# Altium project DIOT_PSU_integrated.PrjPcb
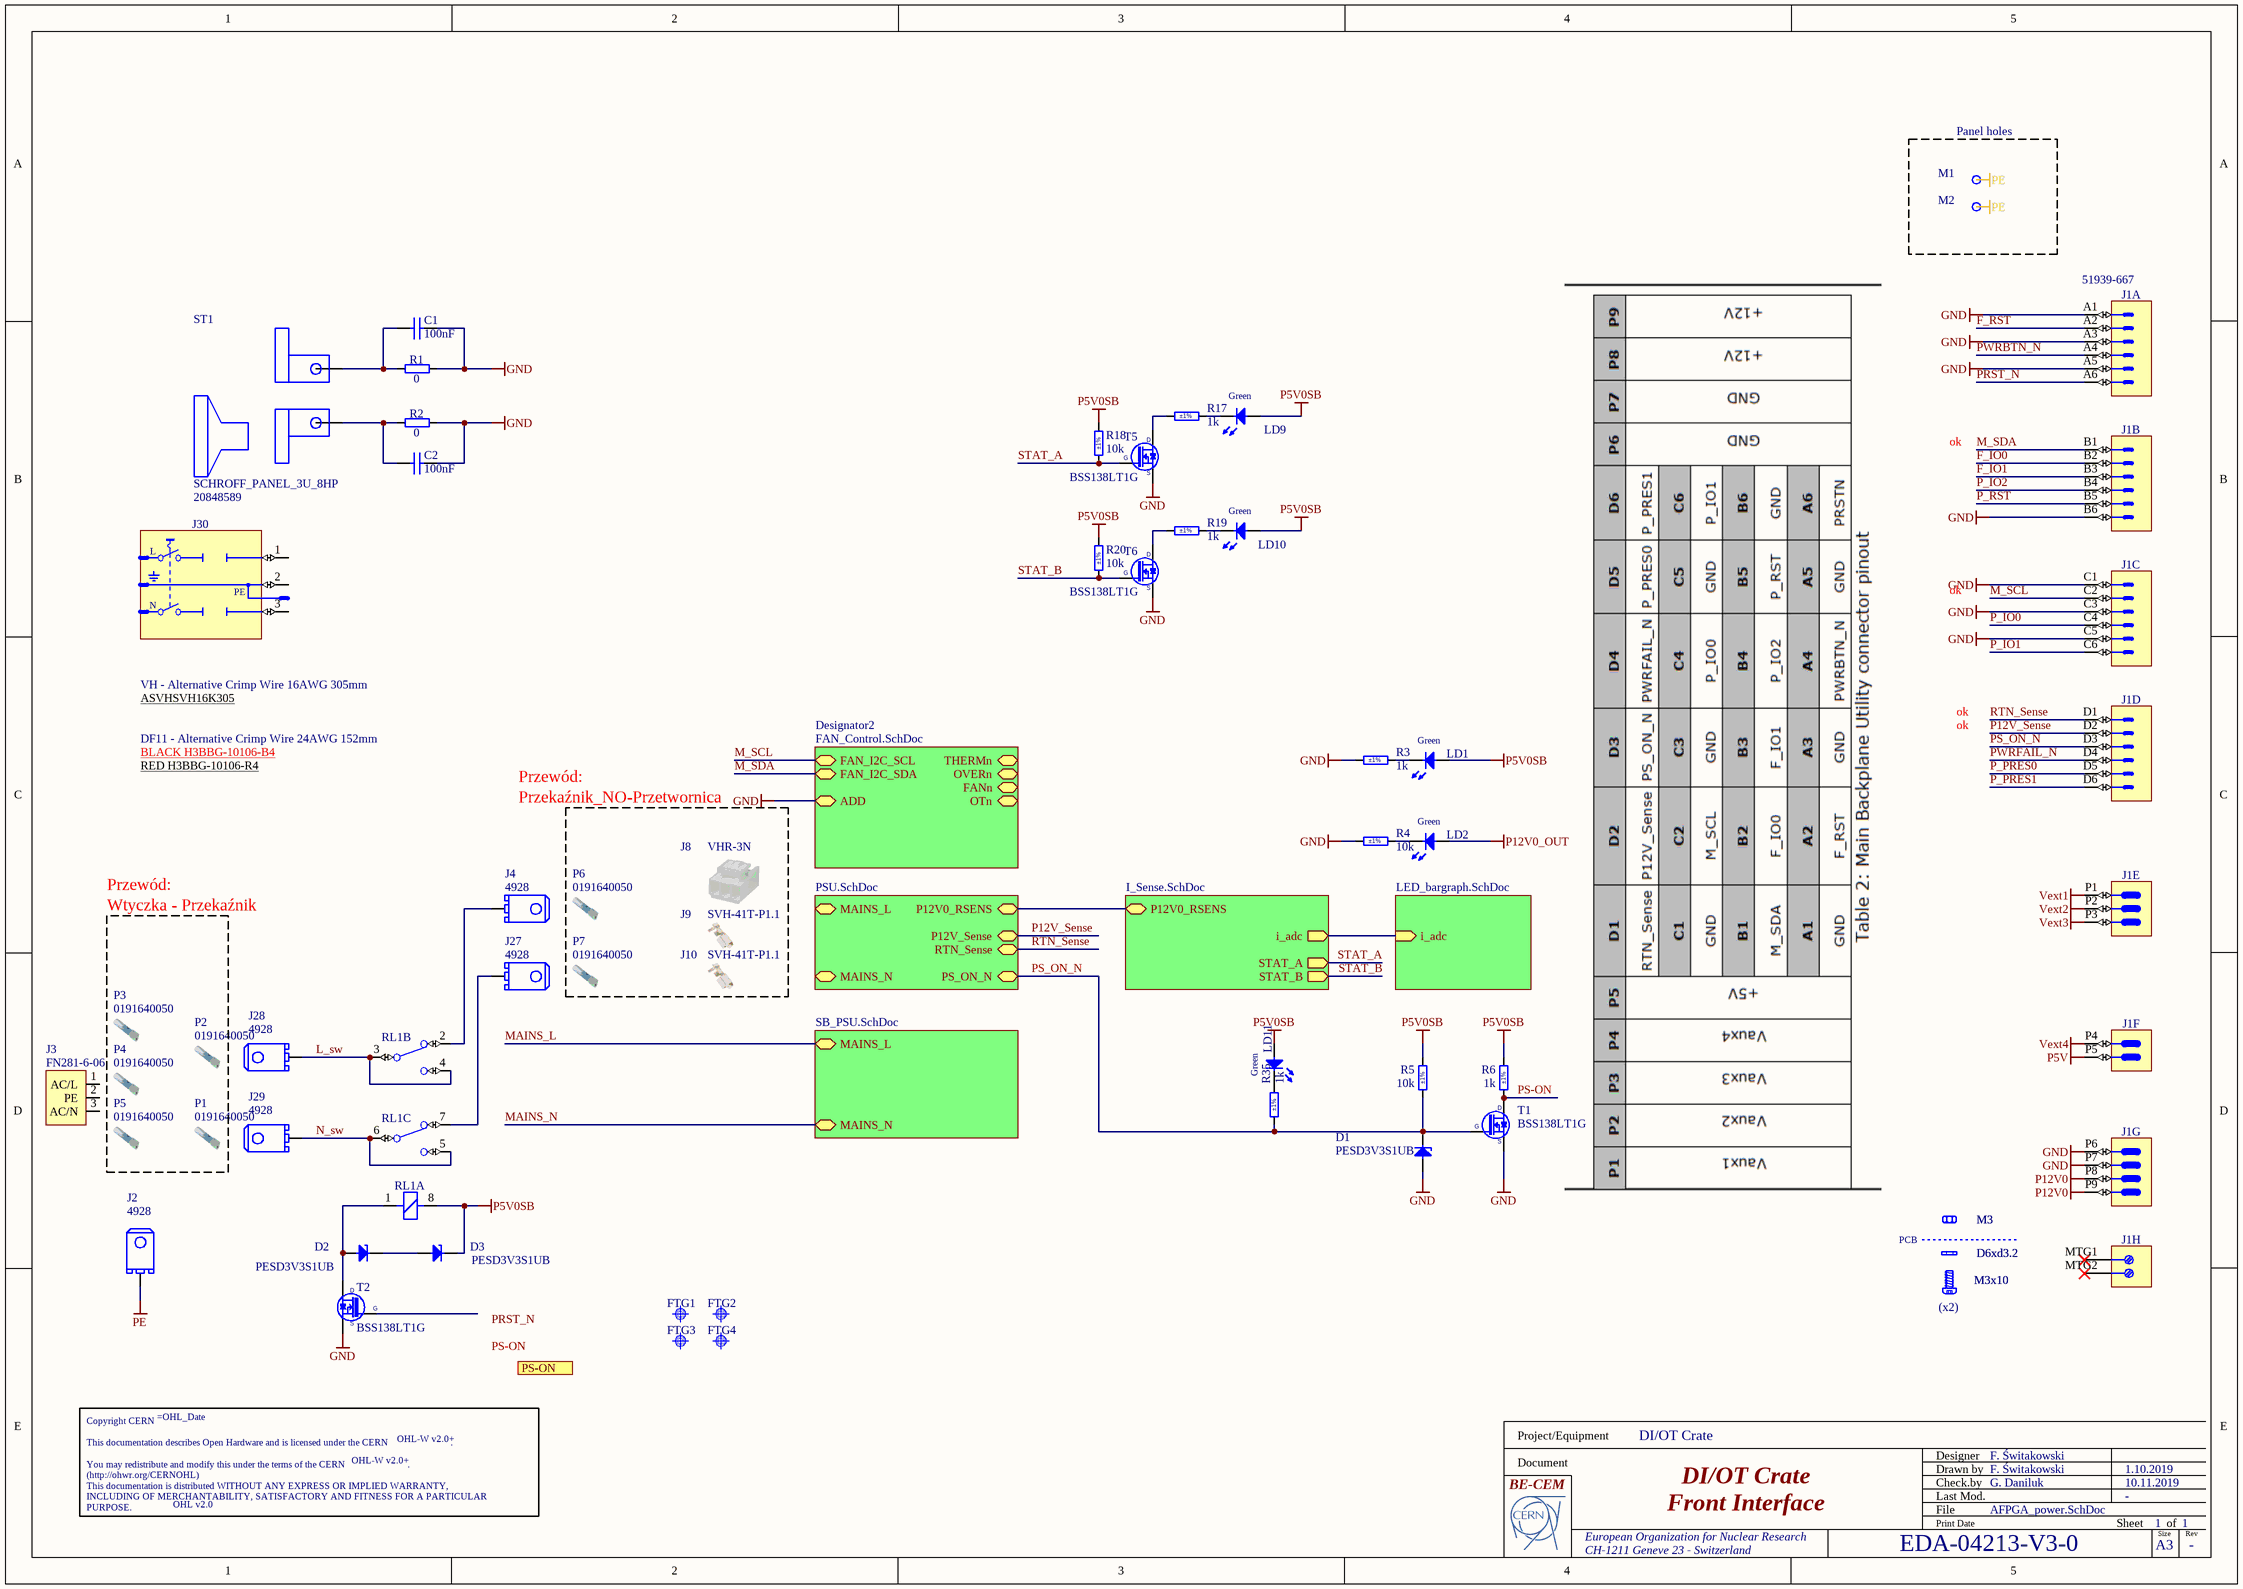
[diagram p0: DIOT_PSU_integrated.SchDoc]
OHL_License: OHL-W v2.0+; wikis: https://ohwr.org/project/diot-crate-hw/wikis
4 sheets, 89 parts. Net scope: hierarchical (ports join the sheet entries above them; power ports are global).
Board files: DIOT_PSU_doutherBoard.PcbDoc, DIOT_PSU_integrated.PcbDoc
Sheets:
  DIOT_PSU_integrated.SchDoc
    Designator2 = FAN_Control.SchDoc
    Designator3 = I_Sense.SchDoc
    Designator5 = SB_PSU.SchDoc

## Sheet DIOT_PSU_integrated.SchDoc: DI/OT Crate
size 420 x 297 mm; Project: DI/OT Backplane - Front panel PCB; CheckedBy: G. Daniluk; Author: F. Świtakowski; CompanyName: Creotech Instruments SA; DrawnBy: F. Świtakowski; Organization: CERN; Address1: European Organization for Nuclear Research; Address2: CH-1211 Geneve 23 - Switzerland; DocumentNumber: 1; Revision: -; SheetNumber: 1; SheetTotal: 1; EDA_Number: EDA-04213-V3-0; Projet: DI/OT Crate; CreateDate: 1.10.2019; CheckedDate: 10.11.2019; Title2: Front Interface; DivGrp: BE-CEM; Designer: F. Świtakowski; SPICEModelCacheTQWPXFHW: <root> / <DocumentId>TQWPXFHW</DocumentId> / </root>; DocumentName: AFPGA_power.SchDoc; ModifiedDate: -; Rule: PcbType=ProtelPcb

### Parts
C1  100nF  [CAPC1608X87N]
C2  100nF  [CAPC1608X87N]
D1  PESD3V3S1UB  [SODFL1608X65N]
D2  PESD3V3S1UB  [SODFL1608X65N]
D3  PESD3V3S1UB  [SODFL1608X65N]
FTG1  Use only in PCB  [FIDUCIAL_TOP_C100-200]  (value not drawn)
FTG2  Use only in PCB  [FIDUCIAL_TOP_S100-200]  (value not drawn)
FTG3  Use only in PCB  [FIDUCIAL_TOP_C100-200]  (value not drawn)
FTG4  Use only in PCB  [FIDUCIAL_TOP_S100-200]  (value not drawn)
J1  Manufacturer Part Number: 51939-667  [AMPHENOL_51939-667]  (hidden comment: PwrBlade)  (parts A,B,C,D,E,F,G,H of 8)
J2  4928  [KEYSTONE_4928]
J3  FN281-6-06  [FN9264-2-06]
J4  4928  [KEYSTONE_4928]
J8  VHR-3N  [VHR-3N]
J9  SVH-41T-P1.1  [SVH-41T-P1.1]
J10  SVH-41T-P1.1  [SVH-41T-P1.1]
J27  4928  [KEYSTONE_4928]
J28  4928  [KEYSTONE_4928]
J29  4928  [KEYSTONE_4928]
J30  IEC  [SCHURTER_DD21.0121.1111]  (value not drawn)
LD1  Green  [LED_AVAGO_HSME-C120]
LD2  Green  [LED_AVAGO_HSME-C120]
LD9  Green  [LED_AVAGO_HSME-C120]
LD10  Green  [LED_AVAGO_HSME-C120]
LD11  Green  [LED_AVAGO_HSME-C120]
M1  Plated Hole  [MTG300_600]  (value not drawn)  (no BOM)
M2  Plated Hole  [MTG300_600]  (value not drawn)  (no BOM)
NUT1  M3  [BOSSARD_BN628-1241443_v]
NUT2  M3  [BOSSARD_BN628-1241443_v]
OHL1  CERN_OHL  [CERN_OHL]  (value not drawn)  (no BOM)
P1  0191640050  [0191640050]
P2  0191640050  [0191640050]
P3  0191640050  [0191640050]
P4  0191640050  [0191640050]
P5  0191640050  [0191640050]
P6  0191640050  [0191640050]
P7  0191640050  [0191640050]
R1  0  [RESC1608X55N]
R2  0  [RESC1608X55N]
R3  1k  Tolerance: ±1%  [RESC1608X55N]
R4  10k  Tolerance: ±1%  [RESC1608X55N]
R5  10k  Tolerance: ±1%  [RESC1608X55N]
R6  1k  Tolerance: ±1%  [RESC1608X55N]
R17  1k  Tolerance: ±1%  [RESC1608X55N]
R18  10k  Tolerance: ±1%  [RESC1608X55N]
R19  1k  Tolerance: ±1%  [RESC1608X55N]
R20  10k  Tolerance: ±1%  [RESC1608X55N]
R35  1k  Tolerance: ±1%  [RESC1608X55N]
RL1  REL_OMRON_G2RL-24  [REL_OMRON_G2RL-24]  (value not drawn)  (parts A,B,C of 3)
SCREW1  M3x10  [BOSSARD_BN5687-3061608_v]
SCREW2  M3x10  [BOSSARD_BN5687-3061608_v]
ST1  SCHROFF_PANEL_3U_8HP  Manufacturer Part Number 2: 20848589  [SCHROFF_PANEL_3HP_8U_CPCIS_AC_PSU]
T1  BSS138LT1G  [SOT95P240X110-3N]
T2  BSS138LT1G  [SOT95P240X110-3N]
T5  BSS138LT1G  [SOT95P240X110-3N]
T6  BSS138LT1G  [SOT95P240X110-3N]
WASHER1  D6xd3.2  [BOSSARD_BN83728-8243964_v]
WASHER2  D6xd3.2  [BOSSARD_BN83728-8243964_v]

### Blocks framed on the sheet
Panel holes: M1 M2
Wtyczka - Przekaźnik: P1-P5

### Sub-sheets
Designator1 = LED_bargraph.SchDoc (file not in this document): i_adc (in)
Designator2 = FAN_Control.SchDoc: ADD (bidir), THERMn (bidir), OVERn (bidir), FANn (bidir), FAN_I2C_SCL (bidir), FAN_I2C_SDA (bidir), OTn (bidir)
Designator3 = I_Sense.SchDoc: i_adc (out), STAT_A (out), STAT_B (out), P12V0_RSENS (bidir)
Designator4 = PSU.SchDoc (file not in this document): P12V_Sense (bidir), RTN_Sense (bidir), PS_ON_N (bidir), MAINS_L (bidir), MAINS_N (bidir), P12V0_RSENS (bidir)
Designator5 = SB_PSU.SchDoc: MAINS_L (bidir), MAINS_N (bidir)

### Ports
PS-ON (in)

### Nets
GND: C1.1 C2.1 D1.2(A) J1.A1 J1.A3 J1.A5 J1.B6 J1.C1 J1.C3 J1.C5 J1.P6 J1.P7 R1.2 R2.2 R3.1 R4.1 T1.2(S) T2.2(S) T5.2(S) T6.2(S) ; sheet Designator2/ADD
P5V: J1.P5
P5V0SB: D3.1(C) LD1.2(A) LD9.2(A) LD10.2(A) LD11.2(A) R5.2 R6.2 R18.2 R20.2 RL1.8
P12V0: J1.P8 J1.P9
P12V0_OUT: LD2.2(A)
PE: J2.1 M1.1 M2.1
Vext1: J1.P1
Vext2: J1.P2
Vext3: J1.P3
Vext4: J1.P4
F_IO0: J1.B2
F_IO1: J1.B3
F_RST: J1.A2
i_adc: sheet Designator1/i_adc, sheet Designator3/i_adc
L_sw: J28.1 RL1.3(C) RL1.4(NO)
M_SCL: J1.C2 ; sheet Designator2/FAN_I2C_SCL
M_SDA: J1.B1 ; sheet Designator2/FAN_I2C_SDA
N_sw: J29.1 RL1.5(NO) RL1.6(C)
P12V0_RSENS: sheet Designator3/P12V0_RSENS, sheet Designator4/P12V0_RSENS
P12V_Sense: J1.D2 ; sheet Designator4/P12V_Sense
P_IO0: J1.C4
P_IO1: J1.C6
P_IO2: J1.B4
P_PRES0: J1.D5
P_PRES1: J1.D6
P_RST: J1.B5
PRST_N: J1.A6
PS-ON: R6.1 T1.3(D)
PS_ON_N: D1.1(C) J1.D3 R5.1 R35.1 T1.1(G) ; sheet Designator4/PS_ON_N
PWRBTN_N: J1.A4
PWRFAIL_N: J1.D4
RTN_Sense: J1.D1 ; sheet Designator4/RTN_Sense
STAT_A: R18.1 T5.1(G) ; sheet Designator3/STAT_A
STAT_B: R20.1 T6.1(G) ; sheet Designator3/STAT_B
NetC1_2: C1.2 R1.1 ST1.MH1
NetC2_2: C2.2 R2.1 ST1.MH2
NetD2_1: D2.1(C) D3.2(A)
NetD2_2: D2.2(A) RL1.1 T2.3(D)
NetJ4_1: J4.1 RL1.2(NC)
NetJ27_1: J27.1 RL1.7(NC)
NetLD1_1: LD1.1(C) R3.2
NetLD2_1: LD2.1(C) R4.2
NetLD9_1: LD9.1(C) R17.2
NetLD10_1: LD10.1(C) R19.2
NetLD11_1: LD11.1(C) R35.2
NetR17_1: R17.1 T5.3(D)
NetR19_1: R19.1 T6.3(D)

Not connected (* = marked no-connect by the designer): J1 MTG1* MTG2*; J3 1(AC/L) 2(PE) 3(AC/N); J30 1 2 3; T2 1(G)

### Notes on the sheet
- ok
- ASVHSVH16K305 <https://www.digikey.pl/en/products/detail/jst-sales-america-inc/ASVHSVH16K305/6009483>
- VH - Alternative Crimp Wire 16AWG 305mm
- DF11 - Alternative Crimp Wire 24AWG 152mm
- BLACK H3BBG-10106-B4 <https://www.digikey.pl/en/products/detail/jst-sales-america-inc/ASVHSVH16K203/9924197>
- RED H3BBG-10106-R4 <https://www.digikey.pl/en/products/detail/hirose-electric-co-ltd/H3BBG-10106-R4/312538?s=N4IgTCBcDaIBIGYBCSDiBaAjABhwNnQCUAWEAXQF8g>
- Przewód:
- (near J8) Przekaźnik_NO-Przetwornica
- PCB
- (x2)
- Labels drawn without touching a wire or pin: PRST_N, PS-ON
- Project/Equipment
- Document
- Designer
- Drawn by
- Check.by
- File
- Last Mod.
- Print Date
- Sheet
- Size
- A3
- of
- Rev
- (in symbol CERN_OHL) Copyright CERN / This documentation describes Open Hardware and is licensed under the CERN                         . / You may redistribute and modify this under the terms of the CERN                         . / (http://ohwr.org/CERNOHL) / This documentation is distributed WITHOUT ANY EXPRESS OR IMPLIED WARRANTY, / INCLUDING OF MERCHANTABILITY, SATISFACTORY AND FITNESS FOR A PARTICULAR PURPOSE. / Please see the CERN                   for applicable conditions.
- (in symbol SCHURTER_DD21.0121.1111) L; PE; N

### Library data of the parts
C1 C2 = CC0603_100NF_50V_10%_X5R: Non-polarised capacitor; Part Description: SMD Multilayer Chip Ceramic Capacitor; Manufacturer: GENERIC; Manufacturer1 Part Number: C1608X5R1H104K080; Voltage: 50V; TC: X5R; Tolerance: ±10%; Part Number: CC0603_100NF_50V_10%_X5R; Component Kind: Standard; Component Type: Standard; Pin Count: 2; Value: 100nF; Status: None; Manufacturer Part Number: CC0603_100NF_50V_10%_X5R; Case: 0603; Mounted: Yes; Socket: No; SMD: Yes; Sense: No; Manufacturer1 Example: TDK; Manufacturer1 ComponentHeight: 0.9mm; HelpURL: \\cern.ch\dfs\Applications\Altium\Datasheets\CC0603_X5R_TDK_C.pdf; Author: CERN DEM MR; CreateDate: 08.01.2016; LatestRevisionDate: 08.01.2016
D1-D3 = PESD3V3S1UB: ESD protection diode; Part Description: ESD protection diode (23kV); Manufacturer: NXP SEMICONDUCTORS; Voltage: 3V3; Power: 330W; PressFit: No; Bonding: No; Part Number: PESD3V3S1UB; Component Kind: Standard; Component Type: Standard; Device: PESD3V3S1UB; PackageDescription: Ultra Small Outline Diode Flat Lead (SOD-523), Body; 1.2mm L X 0.8mm W X 0.65mm H, IPC Medium Density; Manufacturer Part Number: PESD3V3S1UB; Pin Count: 2; Case: SOD523; Mounted: Yes; Socket: No; SMD: Yes; Sense: No; ComponentHeight: 0.65mm; HelpURL: \\cern.ch\dfs\Applications\Altium\Datasheets\PESD3V3S1UB.pdf; Author: CERN DEM JLC; CreateDate: 29.11.2012; LatestRevisionDate: 29.11.2012
FTG1 FTG3 = FIDUCIAL_TARGET_C100-200: Fiducial Target; Part Description: Round Fiducial Target, Top Layer, 1.0mm, Top Solder 2.0mm, Keepout =2.0mm; Mounted: No; Part Number: FIDUCIAL_TARGET_C100-200; Component Kind: Standard (No BOM); Component Type: Standard (No BOM); Pin Count: 1; Family: Fiducial; Socket: No; SMD: Yes; Sense: No; Status: None; ComponentHeight: 0mm; HelpURL: Undefined; Author: CERN DEM JLC; CreateDate: 09.02.2010; LatestRevisionDate: 04.04.2012; PackageDescription: Round Fiducial Target, Top Layer, 1.0mm, Top Solder 2.0mm, Keepout =2.0mm
FTG2 FTG4 = FIDUCIAL_TARGET_S100-200: Fiducial Target; Part Description: Square Fiducial Target, Top Layer, 1.0mm, Top Solder 2.0mm, Keepout =2.0mm; Mounted: No; Part Number: FIDUCIAL_TARGET_S100-200; Component Kind: Standard (No BOM); Component Type: Standard (No BOM); Pin Count: 1; Family: Fiducial; Socket: No; SMD: Yes; Sense: No; Status: None; ComponentHeight: 0mm; HelpURL: Undefined; Author: CERN DEM JLC; CreateDate: 09.02.2010; LatestRevisionDate: 04.04.2012; PackageDescription: Square Fiducial Target, Top Layer, 1.0mm, Top Solder 2.0mm, Keepout =2.0mm
J1 = AMPHENOL_51939-667: Thru-Hole, Lead 3.43mm, PowerBlade Right Angled Power Connector 3ACP 2P 24S 4P Contacts; Part Description: Right Angle PowerBlade Power Connector 3ACP + 2P + 24S + 4P Contacts; PressFit: No; Part Number: AMPHENOL_51939-667; Component Kind: Standard; Component Type: Standard; Pin Count: 33; Family: PwrBlade; Mounted: Yes; Socket: No; SMD: No; Sense: No; Status: None; Manufacturer: AMPHENOL; ComponentHeight: 12.57mm; HelpURL: \\cern.ch\dfs\Applications\Altium\Datasheets\AMPHENOL_51939-667.pdf; Author: CERN DEM JLC; CreateDate: 05.03.2019; LatestRevisionDate: 05.03.2019
J2 J4 J27-J29 = KEYSTONE_4928: 0.240" (6.10mm) Quick Connect Male Solder Connector Non-Insulated; PressFit: No; Part Number: 4928; Component Kind: Standard; Component Type: Standard; Pin Count: 4; Mounted: Yes; Socket: No; SMD: No; Sense: No; Status: None; Part Description: 0.240" (6.10mm) Quick Connect Male Solder Connector Non-Insulated; Manufacturer: KEYSTONE; Manufacturer Part Number: 4928; ComponentHeight: 10.49mm; HelpURL: https://www.keyelco.com/product-pdf.cfm?p=14309; Author: LPA; CreateDate: 18.02.2025; LatestRevisionDate: 18.02.2025; ComponentLink1Description: Datasheet; ComponentLink1URL: https://www.keyelco.com/product-pdf.cfm?p=14309
J3 = FN281-6-06: Power Entry Connector Receptacle, Male Blades - Module IEC 320-C14 Panel Mount, Flange; Manufacturer: Schaffner EMC Inc.; PressFit: No; Part Number: FN281-6-06; Footprint: FN281-6-06; Pin Count: 3; Mounted: Yes; Socket: No; SMD: No; Sense: No; Status: None; Part Description: Power Entry Connector Receptacle, Male Blades - Module IEC 320-C14 Panel Mount, Flange; Manufacturer Part Number: FN281-6-06; ComponentHeight: 35; HelpURL: https://www.schaffner.com/product/FN280/Schaffner_datasheet_FN280.pdf; Author: LPA; CreateDate: 08.02.2025; LatestRevisionDate: 08.02.2025; ComponentLink1Description: Datasheet; ComponentLink1URL: https://www.digikey.pl/pl/products/detail/schaffner-emc-inc/FN281-6-06/1997105?srsltid=AfmBOopo_2hCIzMtiGmdja5qUgne8hiecT0bkO3ZLGT1zD_KD1Bja1J0
J8 = VHR-3N: 3 Rectangular Connectors - Housings Receptacle Natural 0.156" (3.96mm); Manufacturer: JST Sales America Inc.; PressFit: No; Part Number: VHR-3N; Component Kind: Standard; Component Type: Standard; Pin Count: 1; Family: VH; Mounted: Yes; Socket: No; SMD: No; Sense: No; Status: None; Part Description: 3 Rectangular Connectors - Housings Receptacle Natural 0.156" (3.96mm); Manufacturer Part Number: VHR-3N; HelpURL: https://www.jst-mfg.com/product/pdf/eng/eVH.pdf; Author: LPA; CreateDate: 09.02.2025; LatestRevisionDate: 09.02.2025
J9 J10 = SVH-41T-P1.1: Socket Contact Tin 16-20 AWG Crimp; Manufacturer: JST Sales America Inc.; PressFit: No; Part Number: SVH-41T-P1.1; Component Kind: Socket Contact; Component Type: Socket Contact; Pin Count: 1; Family: vh; Mounted: Yes; Socket: No; SMD: No; Sense: No; Status: None; Part Description: Socket Contact Tin 16-20 AWG Crimp; Manufacturer Part Number: SVH-41T-P1.1; ComponentHeight: N/A; HelpURL: https://www.jst-mfg.com/product/pdf/eng/eVH.pdf; Author: LPA; CreateDate: 09.02.2025; LatestRevisionDate: 09.02.2025
J30 = SCHURTER_DD21.0121.1111: Connector 3 Male 2P+ 2 Fuse Holder + Line Switch 2 Poles; Part Description: 10A 250Vac IEC Appliance Inlet C14 with Line Switch 2-Pole, Fuseholder 2-Pole for Fuse Links 5x20mm; PressFit: No; Part Number: SCHURTER_DD21.0121.1111; Component Kind: Standard; Component Type: Standard; Pin Count: 3; Family: IEC; Mounted: Yes; Socket: No; SMD: No; Sense: No; Status: None; Manufacturer: SCHURTER; Manufacturer Part Number: DD21.0121.1111; ComponentHeight: 32.3mm; HelpURL: \\cern.ch\dfs\Applications\Altium\Datasheets\SCHURTER_DD21.0121.1111.pdf; Author: CERN DEM JLC; CreateDate: 19.11.2012; LatestRevisionDate: 19.11.2012
LD1 LD2 LD9-LD11 = LED_AVAGO_HSME-C120: LED Green 1C 2A; Part Description: High Performance Right Angle Chip Green LED; Manufacturer: AVAGO TECHNOLOGIES; PressFit: No; Bonding: No; Part Number: LED_AVAGO_HSME-C120; Component Kind: Standard; Component Type: Standard; Color: Green; PackageDescription: Green Chip LED, 2-Leads, Body 1.7x1.1mm, Side Emitting Package; Manufacturer Part Number: HSME-C120; Pin Count: 2; Mounted: Yes; Socket: No; SMD: Yes; Sense: No; ComponentHeight: 0.7mm; HelpURL: \\cern.ch\dfs\Applications\Altium\Datasheets\LED_AVAGO_HSME-C120.pdf; ComponentLink1URL: \\cern.ch\dfs\Applications\Altium\Datasheets\LED_AVAGO_HSME-C110_DESIGN-GUIDE.pdf; ComponentLink1Description: Design Guide; Author: CERN DEM JMW; CreateDate: 22.07.2009; LatestRevisionDate: 20.06.2012
M1 M2 = PLATED_HOLE3.0_PAD6.0: Single Terminal Socket; Part Description: Plated Through Hole: Hole Dia.=3.0mm Pad Dia.=6.0mm; Mounted: No; Part Number: PLATED_HOLE3.0_PAD6.0; Component Type: Standard (No BOM); Pin Count: 1; Family: Plated Hole; Socket: No; SMD: No; Status: None; ComponentHeight: 0mm; Author: CERN DEM JLC; CreateDate: 26.05.2008; LatestRevisionDate: 26.05.2008; PackageDescription: Plated Through Hole: Hole Dia.=3.0mm Pad Dia.=6.0mm; Sense: No; HelpURL: Undefined
NUT1 NUT2 = BOSSARD_BN628-1241443_v: Nut; Part Description: M3 Hexagon Nut ~0,8d, ISO 4032, DIN 934, Stainless Steel A2; Manufacturer Part Number: BN628 Art.1241443; PressFit: No; Part Number: BOSSARD_BN628-1241443_v; Component Kind: Standard; Component Type: Mechanical; Pin Count: 0; PackageDescription: M3 Hexagon Nut ~0,8d, ISO 4032, DIN 934, Stainless Steel A2; Mounted: Yes; Socket: No; SMD: No; Sense: No; Status: None; Value: M3; Manufacturer: BOSSARD; ComponentHeight: 2.4mm; HelpURL: \\cern.ch\dfs\Applications\Altium\Datasheets\BOSSARD_BN628-1241443.pdf; Author: CERN DEM JMW; CreateDate: 04.12.2015; LatestRevisionDate: 04.12.2015
OHL1 = CERN_OHL: Part Description: Copyright CERN; OHL_License: OHL-W v2.0+; OHL_Version: OHL v2.0; Mounted: No; OHL_Date: =Year; Part Number: CERN_OHL; Component Type: Standard (No BOM); Pin Count: 0; Socket: No; SMD: No; Sense: No; Status: None; ComponentHeight: 0mm; HelpURL: Undefined; Author: CERN DEM HF; CreateDate: 03.12.2021; LatestRevisionDate: 03.12.2021; PackageDescription: Texte Copyright Cern
P1-P7 = 0191640050: 0.250" (6.35mm) Quick Connect Female 14-16 AWG Crimp Connector Fully Insulated Heat Shrink; Manufacturer: Molex; PressFit: No; Part Number: 0191640050; Component Kind: Socket Contact; Component Type: Socket Contact; Pin Count: 1; Family: Perma-Seal; Mounted: Yes; Socket: No; SMD: No; Sense: No; Status: None; Part Description: 0.250" (6.35mm) Quick Connect Female 14-16 AWG Crimp Connector Fully Insulated Heat Shrink; Manufacturer Part Number: 0191640050; ComponentHeight: N/A; HelpURL: https://www.molex.com/en-us/products/part-detail/191640050?display=pdf; Author: LPA; CreateDate: 18.02.2025; LatestRevisionDate: 18.02.2025; ComponentLink1Description: Datasheet; ComponentLink1URL: https://www.molex.com/en-us/products/part-detail/191640050?display=pdf
R1 R2 = R0603_0R_JUMPER: Resistor; Part Description: 1A (0.05R Max DC Resistance) Zero Ohm Jumper; Manufacturer: GENERIC; Manufacturer1 Part Number: NRC06Z0; PressFit: No; Part Number: R0603_0R_JUMPER; Component Kind: Standard; Component Type: Standard; Pin Count: 2; Value: 0; Status: Preferred; Manufacturer Part Number: R0603_0R_JUMPER; Case: 0603; Mounted: Yes; Sense: No; Socket: No; SMD: Yes; Manufacturer1 Example: NIC COMPONENT; Manufacturer1 ComponentHeight: 0.55mm; HelpURL: \\cern.ch\dfs\Applications\Altium\Datasheets\R0603_NIC_NRC.pdf; Author: CERN DEM JLC; CreateDate: 03.12.2007; LatestRevisionDate: 13.03.2008
R3 R6 R17 R19 R35 = R0603_1K_1%_0.1W_100PPM: Resistor - 1%; Part Description: General Purpose Thick Film Chip Resistor; Manufacturer: GENERIC; Manufacturer1 Part Number: NRC06F1001TRF; Power: 0.1W; TC: ±100ppm/°C; PressFit: No; Part Number: R0603_1K_1%_0.1W_100PPM; Component Kind: Standard; Component Type: Standard; Pin Count: 2; Value: 1k; Status: Preferred; Manufacturer Part Number: R0603_1K_1%_0.1W_100PPM; Case: 0603; Mounted: Yes; Sense: No; Socket: No; SMD: Yes; Manufacturer1 Example: NIC COMPONENT; Manufacturer1 ComponentHeight: 0.55mm; HelpURL: \\cern.ch\dfs\Applications\Altium\Datasheets\R0603_NIC_NRC.pdf; Author: CERN DEM JLC; CreateDate: 03.12.2007; LatestRevisionDate: 13.03.2008
R4 R5 R18 R20 = R0603_10K_1%_0.1W_100PPM: Resistor - 1%; Part Description: General Purpose Thick Film Chip Resistor; Manufacturer: GENERIC; Manufacturer1 Part Number: NRC06F1002TRF; Power: 0.1W; TC: ±100ppm/°C; PressFit: No; Part Number: R0603_10K_1%_0.1W_100PPM; Component Kind: Standard; Component Type: Standard; Pin Count: 2; Value: 10k; Status: Preferred; Manufacturer Part Number: R0603_10K_1%_0.1W_100PPM; Case: 0603; Mounted: Yes; Sense: No; Socket: No; SMD: Yes; Manufacturer1 Example: NIC COMPONENT; Manufacturer1 ComponentHeight: 0.55mm; HelpURL: \\cern.ch\dfs\Applications\Altium\Datasheets\R0603_NIC_NRC.pdf; Author: CERN DEM JLC; CreateDate: 03.12.2007; LatestRevisionDate: 13.03.2008
RL1 = REL_OMRON_G2RL-24-DC5: DPDT Power Relay, G2RL Series; Part Description: 8A@250VAC, DPDT Power Relay, G2RL Series; Manufacturer: OMRON ELECTRONIC; PressFit: No; Sense Comment: Sensitive=No (Component Sealed); Value: 5VDC; Part Number: REL_OMRON_G2RL-24-DC5; Component Kind: Standard; Component Type: Standard; Pin Count: 8; PackageDescription: 8 Leads, Row Spacing 7.5mm; Body 29mm x 12.7mm, OMRON_G2RL Series; Mounted: Yes; Socket: No; SMD: No; Sense: No; Status: None; Manufacturer Part Number: G2RL-24-DC5; ComponentHeight: 15.7mm; HelpURL: \\cern.ch\dfs\Applications\Altium\Datasheets\REL_OMRON_G2RL-24.pdf; Author: CERN DEM BC; CreateDate: 11.09.2023; LatestRevisionDate: 11.09.2023
SCREW1 SCREW2 = BOSSARD_BN5687-3061608_v: Screw; Part Description: M3 L=10mm Hexalobular Socket Pan Head Screw, Fully Threaded, Stainless Steel A2; Manufacturer Part Number: BN5687 Art.3061608; PressFit: No; Part Number: BOSSARD_BN5687-3061608_v; Component Kind: Standard; Component Type: Mechanical; Pin Count: 0; PackageDescription: M3 L=10mm Hexalobular Socket Pan Head Screw, Fully Threaded - Stainless Steel A2; Mounted: Yes; Socket: No; SMD: No; Sense: No; Status: None; Value: M3x10; Manufacturer: BOSSARD; ComponentHeight: 12.4mm; HelpURL: \\cern.ch\dfs\Applications\Altium\Datasheets\BOSSARD_BN5687-3061608.pdf; Author: CERN DEM JLC; CreateDate: 22.08.2013; LatestRevisionDate: 22.08.2013
ST1 = SCHROFF_PANEL_3U_8HP_CPCIS_PSU: Schroff 8HP 4U EUROCARD Panel with ejector; Manufacturer: Schroff; Manufacturer Part Number: 20848589
T1 T2 = BSS138LT1G: N-CHANNEL MOSFET WITH DIODE; Part Description: 50V, 200mA N-Channel Enhancement Mode Field-Effect Transistor; Manufacturer: ON SEMICONDUCTOR; PressFit: No; Bonding: No; Part Number: BSS138LT1G; Component Kind: Standard; Component Type: Standard; Device: BSS138LT1G; PackageDescription: SOT23, 0.95mm Pitch; 3 Pin, 1.40mm W X 3.00mm L X 1.10mm H body, IPC Medium Density; Manufacturer Part Number: BSS138L; Pin Count: 3; Case: SOT23-3; Mounted: Yes; Socket: No; SMD: Yes; Sense: No; ComponentHeight: 1.11mm; HelpURL: \\cern.ch\dfs\Applications\Altium\Datasheets\BSS138LT1G.pdf; Author: CERN DEM JLC; CreateDate: 23.03.2009; LatestRevisionDate: 25.05.2022
T5 T6 = BSS138LT1G: N-CHANNEL MOSFET WITH DIODE; Part Description: 50V 200mA N-Channel Enhancement Mode Field-Effect Transistor; Manufacturer: ON SEMICONDUCTOR; PressFit: No; Bonding: No; Part Number: BSS138LT1G; Component Kind: Standard; Component Type: Standard; Device: BSS138LT1G; PackageDescription: SOT23 3-Leads, Pitch 0.95mm - Body 1.4x3mm, IPC Medium Density; Manufacturer Part Number: BSS138LT1G; Pin Count: 3; Case: SOT23-3; Mounted: Yes; Socket: No; SMD: Yes; Sense: No; ComponentHeight: 1.11mm; HelpURL: \\cern.ch\dfs\Applications\Altium\Datasheets\BSS138LT1G.pdf; Author: CERN DEM JLC; CreateDate: 23.03.2009; LatestRevisionDate: 23.03.2009
WASHER1 WASHER2 = BOSSARD_BN83728-8243964_v: Washer; Part Description: Waved Spring Washer for M3 Screw - Steel 440-520 HV - Zinc Plated Blue; Manufacturer Part Number: BN83728 Art.8243964; PressFit: No; Part Number: BOSSARD_BN83728-8243964_v; Component Kind: Standard; Component Type: Mechanical; Pin Count: 0; PackageDescription: Waved Spring Washer for M3 Screw, Steel 440-520 HV, Zinc Plated Blue; Mounted: Yes; Socket: No; SMD: No; Sense: No; Status: None; Value: D6xd3.2; Manufacturer: BOSSARD; ComponentHeight: 0.4mm; HelpURL: \\cern.ch\dfs\Applications\Altium\Datasheets\BOSSARD_BN83728-8243964.pdf; Author: CERN DEM JLC; CreateDate: 27.04.2017; LatestRevisionDate: 27.04.2017

## Sheet FAN_Control.SchDoc: Temperature
size 420 x 297 mm; Author: G.K.; CompanyName: WUT; DrawnBy: G.K.; Organization: WUT; Address1: Warsaw Univeristy of Technology; Address2: Nowowiejska 15/19; DocumentNumber: 6; SheetNumber: 6; SheetTotal: 6; EDA_Number: ARTIQ; Projet: Booster RF Power Amplifier; ModifiedBy: -; CreateDate: XX/XX/XXXX; CheckedDate: -; DivGrp: ISE; Designer: G.K.; ModifiedDate: -; ProjectName: Booster RF Power Amplifier
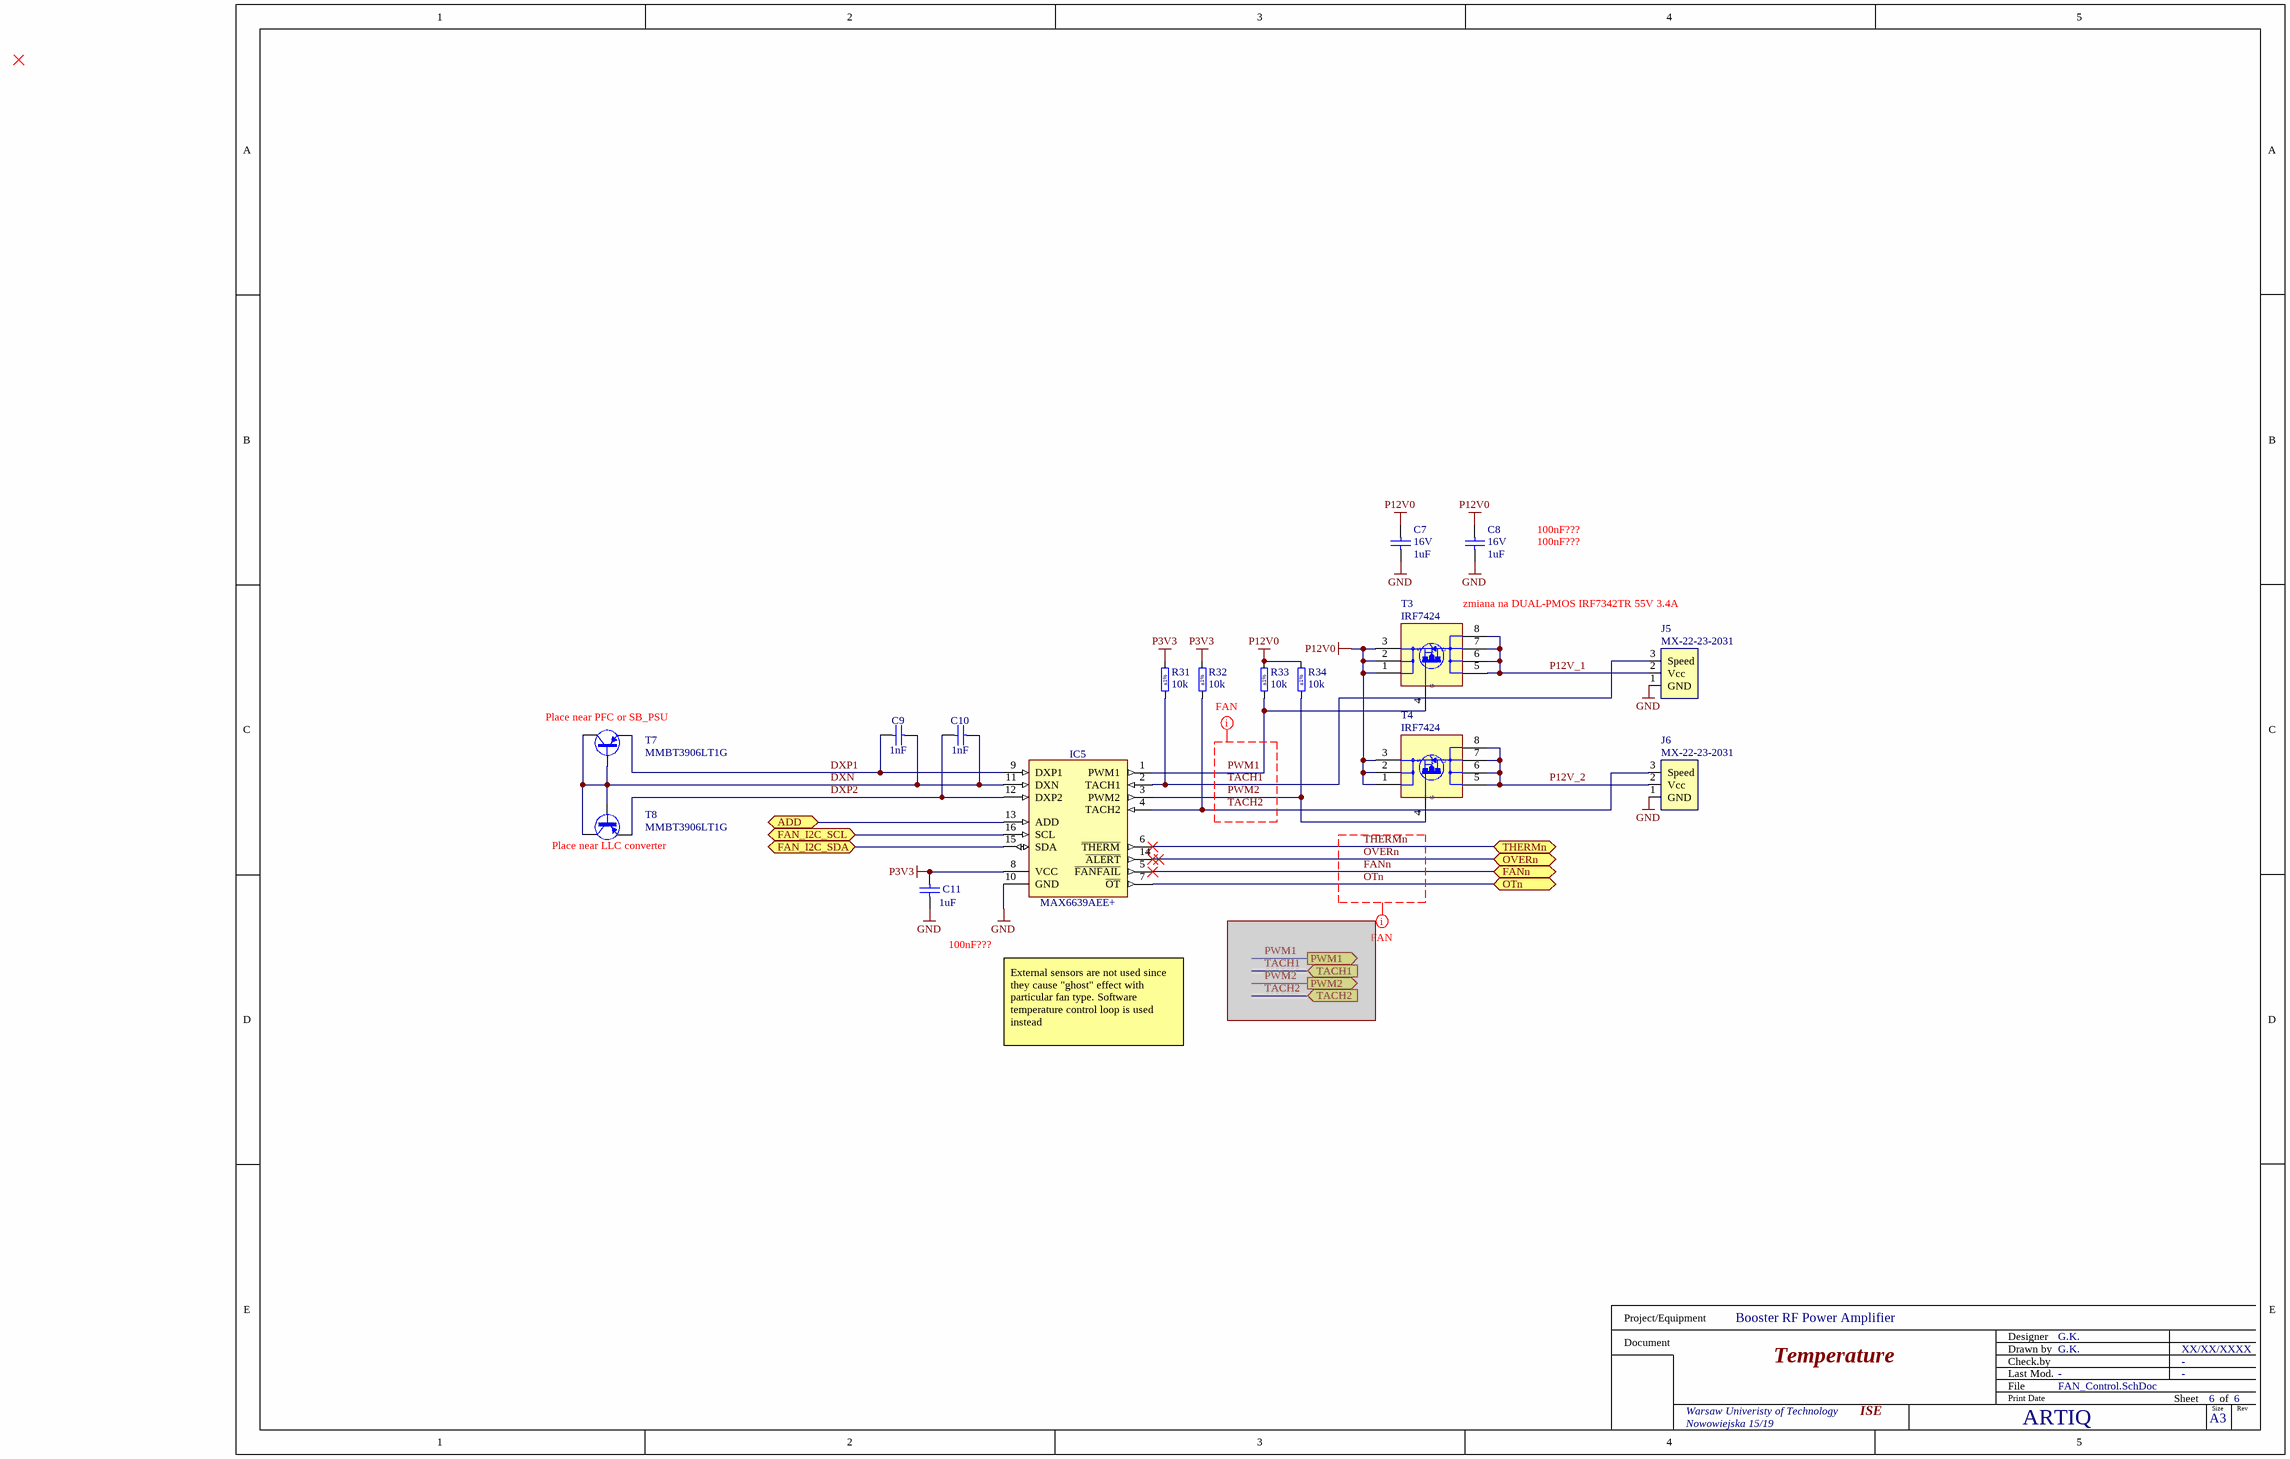
[diagram p1: FAN_Control.SchDoc]

### Parts
C7  1uF  Voltage: 16V  [CAPC1608X87N]
C8  1uF  Voltage: 16V  [CAPC1608X87N]
C9  1nF  [CAPC1608X87N]
C10  1nF  [CAPC1608X87N]
C11  1uF  [CAPC1608X87N]
IC5  MAX6639AEE+  [SOP63P600X175-16N]
J5  MX-22-23-2031  [Molex 22-23-2031]
J6  MX-22-23-2031  [Molex 22-23-2031]
R31  10k  Tolerance: ±1%  [RESC1608X55N]
R32  10k  Tolerance: ±1%  [RESC1608X55N]
R33  10k  Tolerance: ±1%  [RESC1608X55N]
R34  10k  Tolerance: ±1%  [RESC1608X55N]
T3  IRF7424  [SOIC127P600X175-8N]
T4  IRF7424  [SOIC127P600X175-8N]
T7  MMBT3906LT1G  [SOT95P240X110-3N]
T8  MMBT3906LT1G  [SOT95P240X110-3N]

### Ports
ADD (bidir), FAN_I2C_SCL (bidir), FAN_I2C_SDA (bidir), FANn (bidir), OTn (bidir), OVERn (bidir), PWM1 (out), PWM2 (out), TACH1 (in), TACH2 (in), THERMn (bidir)

### Nets
GND: C7.1 C8.1 C11.1 IC5.10(GND) IC5.13(ADD) J5.1(GND) J6.1(GND) ; port ADD
P3V3: C11.2 IC5.8(VCC) R31.2 R32.2
P12V0: C7.2 C8.2 R33.2 R34.2 T3.1(S) T3.2(S) T3.3(S) T4.1(S) T4.2(S) T4.3(S)
DXN: C9.2 C10.2 IC5.11(DXN) T7.1(B) T7.3(C) T8.1(B) T8.3(C)
DXP1: C9.1 IC5.9(DXP1) T7.2(E)
DXP2: C10.1 IC5.12(DXP2) T8.2(E)
FANn: IC5.5(~{FANFAIL}) ; port FANn
M_SCL: IC5.16(SCL) ; port FAN_I2C_SCL
M_SDA: IC5.15(SDA) ; port FAN_I2C_SDA
OTn: IC5.7(~{OT}) ; port OTn
OVERn: IC5.14(~{ALERT}) ; port OVERn
P12V_1: J5.2(Vcc) T3.5(D) T3.6(D) T3.7(D) T3.8(D)
P12V_2: J6.2(Vcc) T4.5(D) T4.6(D) T4.7(D) T4.8(D)
PWM1: IC5.1(PWM1) R33.1 T3.4(G)
PWM2: IC5.3(PWM2) R34.1 T4.4(G)
TACH1: IC5.2(TACH1) J5.3(Speed) R31.1
TACH2: IC5.4(TACH2) J6.3(Speed) R32.1
THERMn: IC5.6(~{THERM}) ; port THERMn

### Layout directives
net class FAN: FANn, OTn, OVERn, PWM1, PWM2, TACH1, TACH2, THERMn

### Notes on the sheet
- 100nF???
- (near T3) zmiana na DUAL-PMOS IRF7342TR 55V 3.4A
- (near T7) Place near PFC or SB_PSU
- (near T8) Place near LLC converter
- External sensors are not used since they cause "ghost" effect with particular fan type. Software temperature control loop is used instead
- Project/Equipment
- Document
- Designer
- Drawn by
- Check.by
- File
- Last Mod.
- Print Date
- Sheet
- Size
- A3
- of
- Rev

### Library data of the parts
C7 C8 = CC0603_1UF_16V_10%_X7R: Non-polarised capacitor; Part Description: SMD Multilayer Chip Ceramic Capacitor; Manufacturer: GENERIC; Manufacturer1 Part Number: 223878615663; TC: X7R; Tolerance: ±10%; Part Number: CC0603_1UF_16V_10%_X7R; Component Kind: Standard; Component Type: Standard; Pin Count: 2; Value: 1uF; Status: None; Manufacturer Part Number: CC0603_1UF_16V_10%_X7R; Case: 0603; Mounted: Yes; Socket: No; SMD: Yes; Manufacturer1 Example: YAGEO PHYCOMP; Manufacturer1 ComponentHeight: 0.9mm; HelpURL: \\cern.ch\dfs\Applications\Altium\Datasheets\CC0603_X7R_PHYCOMP.pdf; Author: CERN DEM JLC; CreateDate: 03.12.2007; LatestRevisionDate: 17.04.2015; Sense: No
C9 C10 = CC0603_1NF_50V_10%_X7R: Non-polarised capacitor; Part Description: SMD Multilayer Chip Ceramic Capacitor; Manufacturer: GENERIC; Manufacturer1 Part Number: 223858615623; Voltage: 50V; TC: X7R; Tolerance: ±10%; Part Number: CC0603_1NF_50V_10%_X7R; Component Kind: Standard; Component Type: Standard; Pin Count: 2; Value: 1nF; Status: Preferred; Manufacturer Part Number: CC0603_1NF_50V_10%_X7R; Case: 0603; Mounted: Yes; Socket: No; SMD: Yes; Sense: No; Manufacturer1 Example: PHYCOMP; Manufacturer1 ComponentHeight: 0.87mm; HelpURL: \\cern.ch\dfs\Applications\Altium\Datasheets\CC0603_X7R_PHYCOMP.pdf; Author: CERN DEM JLC; CreateDate: 03.12.2007; LatestRevisionDate: 03.12.2007
C11 = CC0603_1UF_16V_10%_X7R: Non-polarised capacitor; Part Description: SMD Multilayer Chip Ceramic Capacitor; Manufacturer: GENERIC; Manufacturer1 Part Number: 223878615663; Voltage: 16V; TC: X7R; Tolerance: ±10%; Part Number: CC0603_1UF_16V_10%_X7R; Component Kind: Standard; Component Type: Standard; Pin Count: 2; Value: 1uF; Status: None; Manufacturer Part Number: CC0603_1UF_16V_10%_X7R; Case: 0603; Mounted: Yes; Socket: No; SMD: Yes; Manufacturer1 Example: YAGEO PHYCOMP; Manufacturer1 ComponentHeight: 0.9mm; HelpURL: \\cern.ch\dfs\Applications\Altium\Datasheets\CC0603_X7R_PHYCOMP.pdf; Author: CERN DEM JLC; CreateDate: 03.12.2007; LatestRevisionDate: 17.04.2015; Sense: No
IC5 = MAX6639AEE+: 2-Channel Temperature Monitor with Dual, Automatic, PWM Fan-Speed Controller; Manufacturer: MAXIM; PressFit: No; Bonding: No; Part Number: MAX6639AEE+; Component Kind: Standard; Component Type: Standard; Device: MAX6639AEE+; PackageDescription: SOP, 0.635mm Pitch; 16 Pin, 3.9mm W X 4.895mm L X 1.75mm H body, IPC Medium Density; Part Description: 2-Channel Temperature Monitor with Dual, Automatic, PWM Fan-Speed Controller; Manufacturer Part Number: MAX6639AEE; Pin Count: 16; Case: SSOP16; Mounted: Yes; Socket: No; SMD: Yes; ComponentHeight: 1.75mm; Author: CERN DEM JLC; HelpURL: \\cern.ch\dfs\Applications\Altium\Datasheets\MAX6639AEE+.pdf; CreateDate: 15.08.2012; LatestRevisionDate: 04.04.2022; Sense: No
J5 J6 = MX-22-23-2031: Gniazdo; FAN; przewód-płytka; męskie; PIN:3; 2,54mm; THT; KK 254; proste; Manufacture: Molex; DafaultFootprint: Molex 3-pin; Parameter1: No. of Position; Shop1: TME; Value1: 3; Assembly: THT; ComponentLink1Description: Datasheet; ComponentLink1URL: https://www.tme.eu/pl/Document/dac536c778e10636339fa400de171f1f/MX-22-23-2031.pdf; ComponentSymbol: MX-22-23-2031; ComponentType: Connector; Shop1ID: MX-22-23-2031
R31-R34 = R0603_10K_1%_0.1W_100PPM: as R4 on sheet DIOT_PSU_integrated; Part Number: R0603_10K_1%_0.1W_100PPM; Component Kind: Standard; Component Type: Standard; Pin Count: 2; Value: 10k; Status: Preferred; Manufacturer Part Number: R0603_10K_1%_0.1W_100PPM; Case: 0603; Mounted: Yes; Sense: No; Socket: No; SMD: Yes; Manufacturer1 Example: NIC COMPONENT; Manufacturer1 ComponentHeight: 0.55mm; HelpURL: \\cern.ch\dfs\Applications\Altium\Datasheets\R0603_NIC_NRC.pdf; Author: CERN DEM JLC; CreateDate: 03.12.2007; LatestRevisionDate: 13.03.2008
T3 T4 = IRF7424PBF: 30V 11A P-Channel HEXFET® Power MOSFET; Part Description: -30V -11A P-Channel HEXFET® Power MOSFET; Manufacturer: INTERNATIONAL RECTIFIER; PressFit: No; Bonding: No; Part Number: IRF7424PBF; Component Kind: Standard; Component Type: Standard; Device: IRF7424; PackageDescription: SOIC 8, Pitch 1.27mm - Body 4x5mm, IPC Medium Density; Manufacturer Part Number: IRF7424; Pin Count: 8; Case: SOIC8; Mounted: Yes; Socket: No; SMD: Yes; Sense: No; ComponentHeight: 1.75mm; HelpURL: \\cern.ch\dfs\Applications\Altium\Datasheets\IRF7424PBF.pdf; Author: CERN DEM JLC; CreateDate: 11.01.2011; LatestRevisionDate: 02.06.2022
T7 T8 = MMBT3906LT1G: PNP Transistor; Part Description: 40V 200mA PNP General Purpose Transistor; Manufacturer: ON SEMICONDUCTOR; PressFit: No; Bonding: No; Part Number: MMBT3906LT1G; Component Kind: Standard; Component Type: Standard; Device: MMBT3906LT1G; PackageDescription: SOT23, 0.95mm Pitch; 3 Pin, 1.40mm W X 3.00mm L X 1.10mm H body, IPC Medium Density; Manufacturer Part Number: MMBT3906L; Pin Count: 3; Case: SOT23-3; Mounted: Yes; Socket: No; SMD: Yes; Sense: No; ComponentHeight: 1.1mm; HelpURL: \\cern.ch\dfs\Applications\Altium\Datasheets\MMBT3906LT1G.pdf; Author: CERN DEM JLC; CreateDate: 29.03.2012; LatestRevisionDate: 25.05.2022

## Sheet I_Sense.SchDoc
size A4
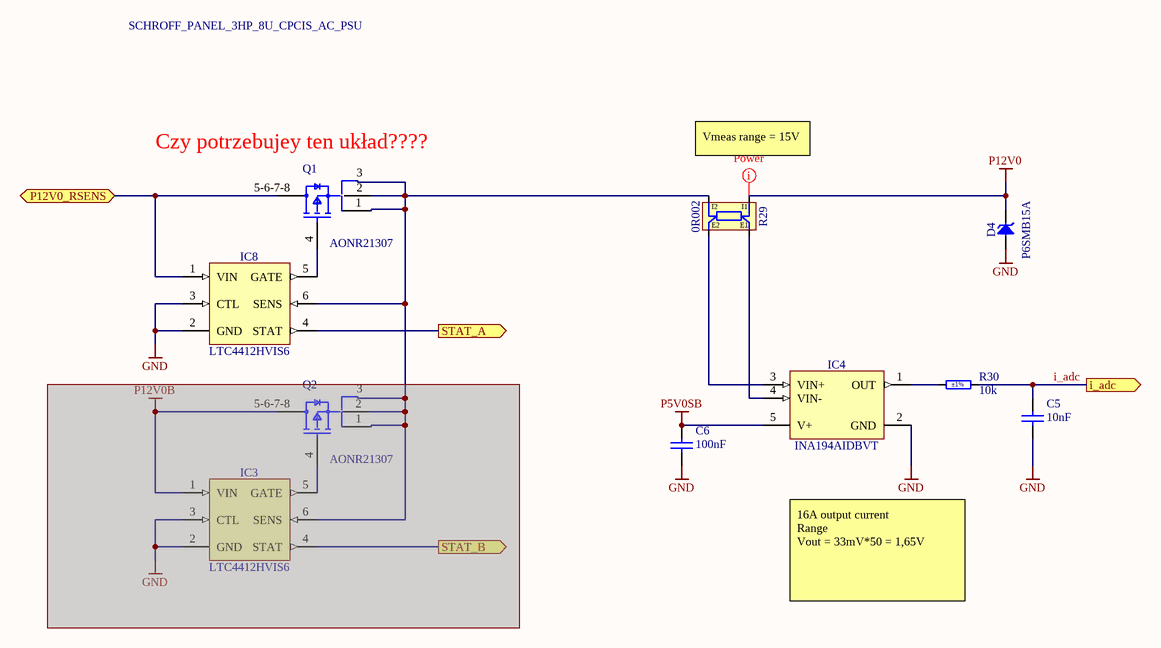
[diagram p2: I_Sense.SchDoc]

### Parts
C5  10nF  [CAPC1608X87N]
C6  100nF  [CAPC1608X87N]
D4  P6SMB15A  [DIOM5436X261N]
IC3  LTC4412HVIS6  [SOT95P280X100-6N]  (masked out: inside a compile mask, not in the netlist)
IC4  INA194AIDBVT  [SOT95P280X145-5N]
IC8  LTC4412HVIS6  [SOT95P280X100-6N]
Q1  AONR21307  [FP-DFN3x3A_8L_EP1_P-MFG]
Q2  AONR21307  [FP-DFN3x3A_8L_EP1_P-MFG]  (masked out: inside a compile mask, not in the netlist)
R29  0R002  [RES_VISHAY_WSK2512_0R005-0R2]
R30  10k  Tolerance: ±1%  [RESC1608X55N]

### Ports
i_adc (out), P12V0_RSENS (bidir), STAT_A (out), STAT_B (out)

### Nets
GND: C5.1 C6.2 D4.2(A) IC4.2(GND) IC8.2(GND) IC8.3(CTL)
P5V0SB: C6.1 IC4.5(V+)
P12V0: D4.1(C) R29.I1
i_adc: C5.2 R30.2 ; port i_adc
P12V0_RSENS: IC8.1(VIN) Q1.5-6-7-8(D) ; port P12V0_RSENS
STAT_A: IC8.4(STAT) ; port STAT_A
NetIC4_1: IC4.1(OUT) R30.1
NetIC4_3: IC4.3(VIN+) R29.E2
NetIC4_4: IC4.4(VIN-) R29.E1
NetIC8_5: IC8.5(GATE) Q1.4(G)
NetIC8_6: IC8.6(SENS) Q1.1(S) Q1.2(S) Q1.3(S) R29.I2

### Layout directives
net class Power: P12V0

### Notes on the sheet
- SCHROFF_PANEL_3HP_8U_CPCIS_AC_PSU
- (near Q1) Czy potrzebujey ten układ????
- (near R29) Vmeas range = 15V
- 16A output current
  Range
  Vout = 33mV*50 = 1,65V

### Library data of the parts
C5 = CC0603_10NF_50V_10%_X7R: Non-polarised capacitor; Part Description: SMD Multilayer Chip Ceramic Capacitor; Manufacturer: GENERIC; Manufacturer1 Part Number: 223858615636; Voltage: 50V; TC: X7R; Tolerance: ±10%; Part Number: CC0603_10NF_50V_10%_X7R; Component Kind: Standard; Component Type: Standard; Pin Count: 2; Value: 10nF; Status: Preferred; Manufacturer Part Number: CC0603_10NF_50V_10%_X7R; Case: 0603; Mounted: Yes; Socket: No; SMD: Yes; Sense: No; Manufacturer1 Example: PHYCOMP; Manufacturer1 ComponentHeight: 0.87mm; HelpURL: \\cern.ch\dfs\Applications\Altium\Datasheets\CC0603_X7R_PHYCOMP.pdf; Author: CERN DEM JLC; CreateDate: 03.12.2007; LatestRevisionDate: 03.12.2007
C6 = CC0603_100NF_50V_10%_X5R: as C1 on sheet DIOT_PSU_integrated; Part Number: CC0603_100NF_50V_10%_X5R; Component Kind: Standard; Component Type: Standard; Pin Count: 2; Value: 100nF; Status: None; Manufacturer Part Number: CC0603_100NF_50V_10%_X5R; Case: 0603; Mounted: Yes; Socket: No; SMD: Yes; Sense: No; Manufacturer1 Example: TDK; Manufacturer1 ComponentHeight: 0.9mm; HelpURL: \\cern.ch\dfs\Applications\Altium\Datasheets\CC0603_X5R_TDK_C.pdf; Author: CERN DEM MR; CreateDate: 08.01.2016; LatestRevisionDate: 08.01.2016
D4 = P6SMB15A: Transient Voltage Suppressor Diode (Uni-Directional); Part Description: Uni-directional Transient Voltage Suppressor (TVS) Diode; Manufacturer: LITTELFUSE; Voltage: 15V; Power: 600W; PressFit: No; Bonding: No; Part Number: P6SMB15A; Component Kind: Standard; Component Type: Standard; Device: P6SMB15A; PackageDescription: DO-214-AA/SMB Diode, Molded Body; 5.40mm L X 3.62mm W X 2.61mm H, IPC Medium Density; Manufacturer Part Number: P6SMB15A; Pin Count: 2; Case: SMB; Mounted: Yes; Socket: No; SMD: Yes; Sense: No; ComponentHeight: 2.61mm; HelpURL: \\cern.ch\dfs\Applications\Altium\Datasheets\P6SMB15A.pdf; Author: CERN DEM JLC; CreateDate: 12.07.2017; LatestRevisionDate: 12.07.2017
IC3 IC8 = LTC4412HVIS6#PBF: 36V, Low Loss PowerPathTM Controller in ThinSOT; Part Description: 36V, Low Loss PowerPath Controller in ThinSOT; Manufacturer: LINEAR TECHNOLOGY; PressFit: No; Bonding: No; Part Number: LTC4412HVIS6#PBF; Component Kind: Standard; Component Type: Standard; Device: LTC4412HVIS6; PackageDescription: SOT, 0.95mm Pitch; 6 Pin, 1.625mm W X 2.90mm L X 1.00mm H body, IPC Medium Density; Manufacturer Part Number: LTC4412HVIS6; Pin Count: 6; Case: SOT23-6; Mounted: Yes; Socket: No; SMD: Yes; Sense: No; ComponentHeight: 1mm; Author: CERN DEM JLC; HelpURL: \\cern.ch\dfs\Applications\Altium\Datasheets\LTC4412HVIS6#PBF.pdf; CreateDate: 22.03.2018; LatestRevisionDate: 02.02.2022
IC4 = INA194AIDBVT: Current Shunt Monitor -16V to +80V Common-Mode Range; Manufacturer: TEXAS INSTRUMENTS; PressFit: No; Bonding: No; Part Number: INA194AIDBVT; Component Kind: Standard; Component Type: Standard; Device: INA194AIDBVT; PackageDescription: SOT, 0.95mm Pitch; 5 Pin, 1.60mm W X 2.90mm L X 1.45mm H body, IPC Medium Density; Part Description: Current Shunt Monitor -16V to +80V Common-Mode Range; Manufacturer Part Number: INA194AIDBV; Pin Count: 5; Case: SOT23-5; Mounted: Yes; Socket: No; SMD: Yes; Sense: No; ComponentHeight: 1.45mm; Author: CERN DEM JLC; HelpURL: \\cern.ch\dfs\Applications\Altium\Datasheets\INA194AIDBVT.pdf; CreateDate: 10.05.2010; LatestRevisionDate: 10.05.2010
Q1 Q2 = CMP-83955-000002-1: MOSFET P-CH 30V 3X3 DFN; Manufacturer: Alpha & Omega Semiconductor; Reverse Recovery Time: 13.3ns; Reverse Recovery Charge: 20nC; Turn Off Delay Time: 43.5ns; Max Forward Diode Voltage: -1V; Gate Charge At Vgs: 35nC @ -10V; Threshold Vgs Min: -1.3V; Gate To Source Voltage: 25V; Turn On Delay Time: 11ns; Continuous Drain Current: -24A; Power Dissipation: 5W; Max Junction Temp: +150°C; Number Of P Channels: 1; Drain To Source Voltage: -30V; Standoff Height: 0mm; Input Capacitace At Vds: 1995pF @ -15V; Depletion Mode: False; Threshold Vgs Max: -2.3V; Rthja Max: 45°C/W; Drain To Source Resistance: 9.2mΩ; Pulse Drain Current: -82A; Typ Forward Diode Voltage: -0.7V; Temperature Range Low: -55°C; Device Class L1: Discrete Semiconductors; Footprint Url: http://www.aosmd.com/res/packaging_information/DFN3x3A_8L_EP1_P.pdf; ComponentLink2Description: Datasheet; Device Class L2: Transistors; ComponentLink2URL: http://www.aosmd.com/res/data_sheets/AONR21307.pdf; Automotive: No; Temperature: -55°C to +150°C; Octopart: https://octopart.com/aonr21307-alpha+%26+omega+semiconductor-96014004; RoHS: TRUE; Digikey Description: MOSFET P-CH 30V 3X3 DFN; Drain To Source Breakdown Voltage: -30V; Package: DFN3x3A_8L_EP1_P; Manufacturer Part Number: AONR21307; Category: Trans; Height: 0.9mm; Lead Free: Yes; Device Class L3: MOSFETs; Temperature Range High: +150°C; Number Of Channels: 1
R29 = R2512_0R002_1%_1W_35PPM_VISHAY_WSK: Power and Current Sensing Resistor; Part Description: Power Metal Strip® Resistor, Low Value; Manufacturer: VISHAY DALE; Manufacturer Part Number: WSK25122L000FEA; Power: 1W; TC: ±35ppm/°C; Tolerance: ±1%; PressFit: No; Part Number: R2512_0R002_1%_1W_35PPM_VISHAY_WSK; Component Kind: Standard; Component Type: Standard; Pin Count: 4; Value: 0R002; Status: None; Case: 2512; Mounted: Yes; Sense: No; Socket: No; SMD: Yes; ComponentHeight: 0.89mm; HelpURL: \\cern.ch\dfs\Applications\Altium\Datasheets\R2512_VISHAY_WSK.pdf; Author: CERN DEM MR; CreateDate: 08.11.2016; LatestRevisionDate: 19.02.2018
R30 = R0603_10K_1%_0.1W_100PPM: as R4 on sheet DIOT_PSU_integrated; Part Number: R0603_10K_1%_0.1W_100PPM; Component Kind: Standard; Component Type: Standard; Pin Count: 2; Value: 10k; Status: Preferred; Manufacturer Part Number: R0603_10K_1%_0.1W_100PPM; Case: 0603; Mounted: Yes; Sense: No; Socket: No; SMD: Yes; Manufacturer1 Example: NIC COMPONENT; Manufacturer1 ComponentHeight: 0.55mm; HelpURL: \\cern.ch\dfs\Applications\Altium\Datasheets\R0603_NIC_NRC.pdf; Author: CERN DEM JLC; CreateDate: 03.12.2007; LatestRevisionDate: 13.03.2008

## Sheet SB_PSU.SchDoc
size A4
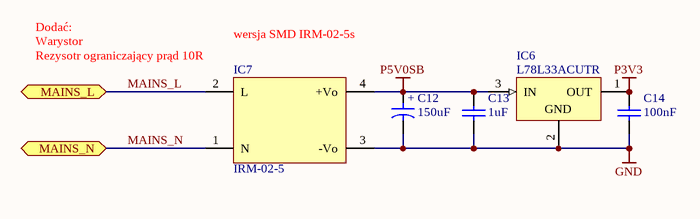
[diagram p3: SB_PSU.SchDoc]

### Parts
C12  150uF  [CAPPR500-1050X800]
C13  1uF  [CAPC1608X87N]
C14  100nF  [CAPC1608X87N]
IC6  L78L33ACUTR  [SOT89]
IC7  IRM-02-5  [PWS_MEANWELL_IRM-02]

### Ports
MAINS_L (bidir), MAINS_N (bidir)

### Nets
GND: C12.2 C13.1 C14.2 IC6.2(GND) IC7.3(-Vo)
P3V3: C14.1 IC6.1(OUT)
P5V0SB: C12.1 C13.2 IC6.3(IN) IC7.4(+Vo)
MAINS_L: IC7.2(L) ; port MAINS_L
MAINS_N: IC7.1(N) ; port MAINS_N

### Notes on the sheet
- Dodać:
- Warystor
- (near IC7) Rezysotr ograniczający prąd 10R
- wersja SMD IRM-02-5s
- (in symbol CAER_150UF_16V_20%_SANYO_16SEQP150M) +

### Library data of the parts
C12 = CAER_150UF_16V_20%_SANYO_16SEQP150M: Polarised capacitor; Part Description: Aluminium Solid Capacitor with Conductive Polymer (SEQP Series); Manufacturer: SANYO OS-CON; Voltage: 16V; Tolerance: ±20%; Part Number: CAER_150UF_16V_20%_SANYO_16SEQP150M; Component Kind: Standard; Component Type: Standard; Pin Count: 2; Value: 150uF; Status: Not Recommended; Manufacturer Part Number: 16SEQP150M; Case: LS5 D10 x H8; Mounted: Yes; Socket: No; SMD: No; Sense: No; ComponentHeight: 8mm; HelpURL: \\cern.ch\dfs\Applications\Altium\Datasheets\CAER_SANYO_SEQP.pdf; Author: CERN DEM JLC; CreateDate: 07.03.2011; LatestRevisionDate: 07.03.2011
C13 = CC0603_1UF_16V_10%_X7R: as C11 on sheet FAN_Control; Part Number: CC0603_1UF_16V_10%_X7R; Component Kind: Standard; Component Type: Standard; Pin Count: 2; Value: 1uF; Status: None; Manufacturer Part Number: CC0603_1UF_16V_10%_X7R; Case: 0603; Mounted: Yes; Socket: No; SMD: Yes; Manufacturer1 Example: YAGEO PHYCOMP; Manufacturer1 ComponentHeight: 0.9mm; HelpURL: \\cern.ch\dfs\Applications\Altium\Datasheets\CC0603_X7R_PHYCOMP.pdf; Author: CERN DEM JLC; CreateDate: 03.12.2007; LatestRevisionDate: 17.04.2015; Sense: No
C14 = CC0603_100NF_50V_10%_X5R: as C1 on sheet DIOT_PSU_integrated; Part Number: CC0603_100NF_50V_10%_X5R; Component Kind: Standard; Component Type: Standard; Pin Count: 2; Value: 100nF; Status: None; Manufacturer Part Number: CC0603_100NF_50V_10%_X5R; Case: 0603; Mounted: Yes; Socket: No; SMD: Yes; Sense: No; Manufacturer1 Example: TDK; Manufacturer1 ComponentHeight: 0.9mm; HelpURL: \\cern.ch\dfs\Applications\Altium\Datasheets\CC0603_X5R_TDK_C.pdf; Author: CERN DEM MR; CreateDate: 08.01.2016; LatestRevisionDate: 08.01.2016
IC6 = L78L33ACUTR: 3-Terminal Regulator 1=OUT 2=GND 3=IN; Part Description: 33V 100mA Positive Voltage Regulator; Manufacturer: ST MICROELECTRONICS; PressFit: No; Bonding: No; Part Number: L78L33ACUTR; Component Kind: Standard; Component Type: Standard; Device: L78L33ACUTR; PackageDescription: SOT89-3, 3-Leads, Body 2.44x4.5mm; Manufacturer Part Number: L78L33ACUTR; Pin Count: 4; Case: SOT89; Mounted: Yes; Socket: No; SMD: Yes; Sense: No; ComponentHeight: 1.6mm; HelpURL: \\cern.ch\dfs\Applications\Altium\Datasheets\L78L33ACUTR.pdf; Author: CERN DEM JLC; CreateDate: 12.05.2014; LatestRevisionDate: 12.05.2014
IC7 = AC_DC_IRM-02-5: Power Supply; Part Description: 85-305VAC to 5VDC (400mA) 2W Power Supply; Manufacturer: MEAN WELL; PressFit: No; Bonding: No; Part Number: IRM-02-5; Component Kind: Standard; Component Type: Standard; Device: IRM-02-5; PackageDescription: IRM-02 Series, Body 33.7x22.2mm, Power Supply; Status: None; Manufacturer Part Number: IRM-02-5; Pin Count: 4; Mounted: Yes; Socket: No; SMD: No; Sense: No; ComponentHeight: 15mm; HelpURL: \\cern.ch\dfs\Applications\Altium\Datasheets\IRM-02-24.pdf; Author: GK; CreateDate: 14.02.2018; LatestRevisionDate: 14.02.2018

## Nets that join several sheets
GND: DIOT_PSU_integrated (20 pins), FAN_Control (7 pins), I_Sense (6 pins), SB_PSU (5 pins)
P3V3: FAN_Control (C11.2 IC5.8 R31.2 R32.2), SB_PSU (C14.1 IC6.1)
P5V0SB: DIOT_PSU_integrated (10 pins), I_Sense (C6.1 IC4.5), SB_PSU (C12.1 C13.2 IC6.3 IC7.4)
P12V0: DIOT_PSU_integrated (J1.P8 J1.P9), FAN_Control (10 pins), I_Sense (D4.1 R29.I1)
M_SCL: DIOT_PSU_integrated (J1.C2), FAN_Control (IC5.16)
M_SDA: DIOT_PSU_integrated (J1.B1), FAN_Control (IC5.15)
STAT_A: DIOT_PSU_integrated (R18.1 T5.1), I_Sense (IC8.4)